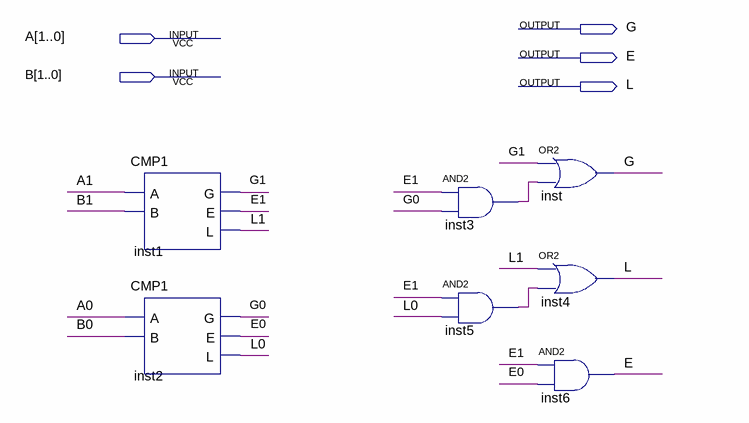
[diagram p0: schematic sheet]
// Quartus schematic CMP2.bdf as structural Verilog: 7 symbols, 5 pins
module CMP2 (
  input  [1:0] A,
  input  [1:0] B,
  output G,
  output E,
  output L
);

  wire E0, E1, G0, G1, inst3_out, inst5_out, L0, L1;

  CMP1 inst1 (.A(A[1]), .B(B[1]), .G(G1), .E(E1), .L(L1));
  CMP1 inst2 (.A(A[0]), .B(B[0]), .G(G0), .E(E0), .L(L0));
  and inst3 (inst3_out, E1, G0);
  and inst5 (inst5_out, E1, L0);
  or inst (G, G1, inst3_out);
  or inst4 (L, L1, inst5_out);
  and inst6 (E, E1, E0);
endmodule
